# Altium schematic sheet DAC_Bank.SchDoc
size A4
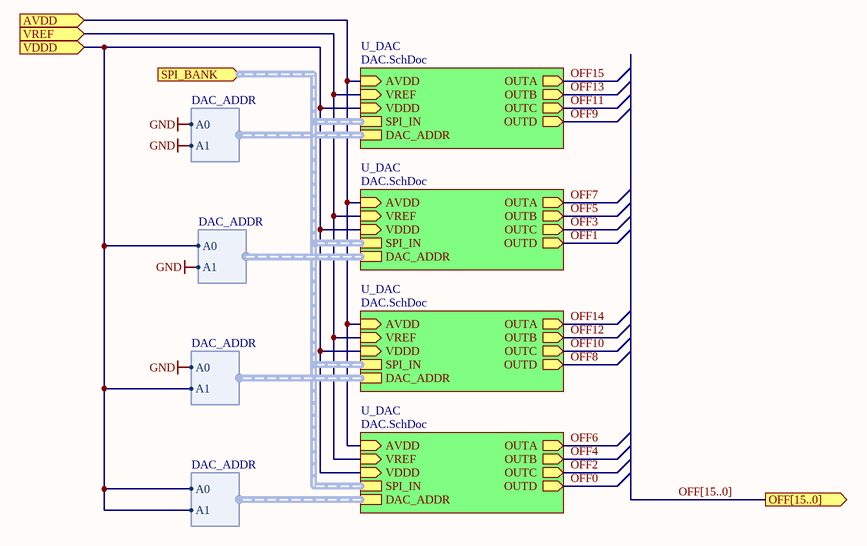
[diagram p0: DAC_Bank.SchDoc]

## Sub-sheets
U_DAC = DAC.SchDoc: AVDD (in), VREF (in), VDDD (in), SPI_IN (harness SPI_DAC), DAC_ADDR (harness DAC_ADDR), OUTA (out), OUTB (out), OUTC (out), OUTD (out)
U_DAC = DAC.SchDoc: AVDD (in), VREF (in), VDDD (in), SPI_IN (harness SPI_DAC), DAC_ADDR (harness DAC_ADDR), OUTA (out), OUTB (out), OUTC (out), OUTD (out)
U_DAC = DAC.SchDoc: AVDD (in), VREF (in), VDDD (in), SPI_IN (harness SPI_DAC), DAC_ADDR (harness DAC_ADDR), OUTA (out), OUTB (out), OUTC (out), OUTD (out)
U_DAC = DAC.SchDoc: AVDD (in), VREF (in), VDDD (in), SPI_IN (harness SPI_DAC), DAC_ADDR (harness DAC_ADDR), OUTA (out), OUTB (out), OUTC (out), OUTD (out)

## Ports
AVDD (in), OFF[15..0] (out), SPI_BANK (in, harness SPI_DAC), VDDD (in), VREF (in)

## Harnesses
DAC_ADDR: A0, A1

## Nets
GND: sheet U_DAC/DAC_ADDR.A0, sheet U_DAC/DAC_ADDR.A1
AVDD: port AVDD, sheet U_DAC/AVDD, sheet U_DAC/AVDD, sheet U_DAC/AVDD, sheet U_DAC/AVDD
OFF0: sheet U_DAC/OUTD
OFF1: sheet U_DAC/OUTD
OFF2: sheet U_DAC/OUTC
OFF3: sheet U_DAC/OUTC
OFF4: sheet U_DAC/OUTB
OFF5: sheet U_DAC/OUTB
OFF6: sheet U_DAC/OUTA
OFF7: sheet U_DAC/OUTA
OFF8: sheet U_DAC/OUTD
OFF9: sheet U_DAC/OUTD
OFF10: sheet U_DAC/OUTC
OFF11: sheet U_DAC/OUTC
OFF12: sheet U_DAC/OUTB
OFF13: sheet U_DAC/OUTB
OFF14: sheet U_DAC/OUTA
OFF15: sheet U_DAC/OUTA
VDDD: port VDDD, sheet U_DAC/VDDD, sheet U_DAC/VDDD, sheet U_DAC/VDDD, sheet U_DAC/VDDD, sheet U_DAC/DAC_ADDR.A0, sheet U_DAC/DAC_ADDR.A1
VREF: port VREF, sheet U_DAC/VREF, sheet U_DAC/VREF, sheet U_DAC/VREF, sheet U_DAC/VREF

## Buses and harness runs
bus OFF[15..0] = port OFF[15..0]
harness port SPI_BANK = sheet U_DAC/SPI_IN